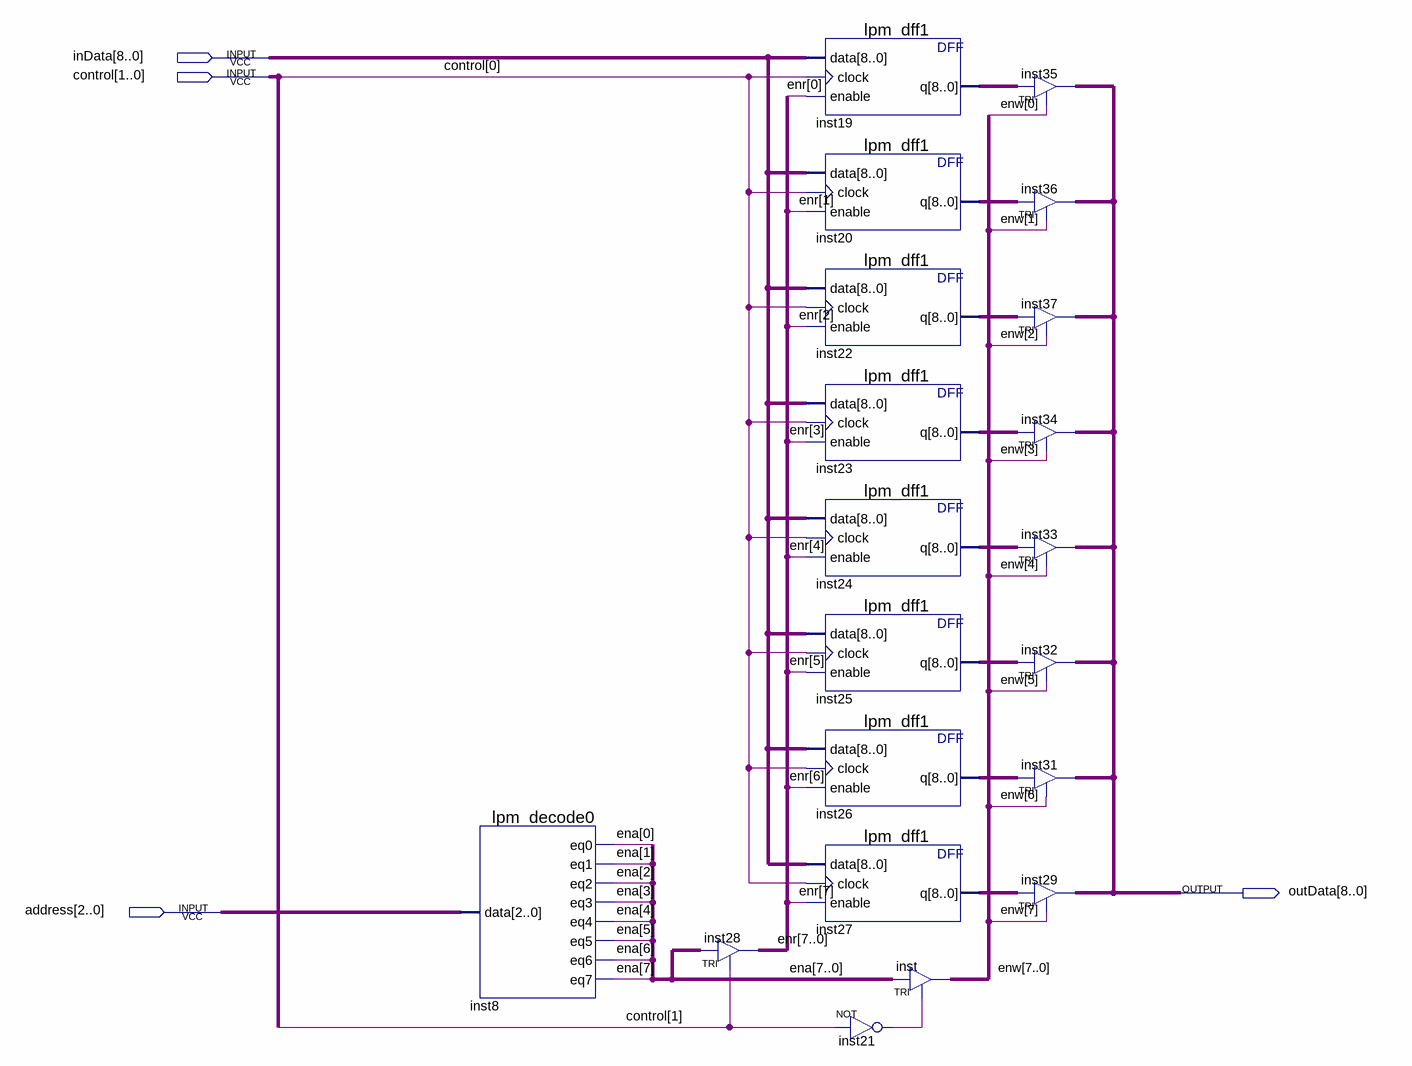
[diagram p0: schematic sheet]
// Quartus schematic REGS.bdf as structural Verilog: 20 symbols, 4 pins
module REGS (
  input  [8:0] inData,
  input  [1:0] control,
  input  [2:0] address,
  output [8:0] outData
);

  wire inst21_out;
  wire [7:0] ena, enr, enw;
  wire [8:0] inst19_q, inst20_q, inst22_q, inst23_q, inst24_q, inst25_q, inst26_q, inst27_q;

  lpm_decode0 inst8 (
    .data(address), .eq0(ena[0]), .eq1(ena[1]), .eq2(ena[2]), .eq3(ena[3]), .eq4(ena[4]), .eq5(ena[5]),
    .eq6(ena[6]), .eq7(ena[7]));
  TRI inst28[7:0] (.IN(ena), .OE(control[1]), .OUT(enr));
  lpm_dff1 inst19 (.data(inData), .clock(control[0]), .enable(enr[0]), .q(inst19_q));
  lpm_dff1 inst20 (.data(inData), .clock(control[0]), .enable(enr[1]), .q(inst20_q));
  lpm_dff1 inst22 (.data(inData), .clock(control[0]), .enable(enr[2]), .q(inst22_q));
  lpm_dff1 inst23 (.data(inData), .clock(control[0]), .enable(enr[3]), .q(inst23_q));
  lpm_dff1 inst24 (.data(inData), .clock(control[0]), .enable(enr[4]), .q(inst24_q));
  lpm_dff1 inst25 (.data(inData), .clock(control[0]), .enable(enr[5]), .q(inst25_q));
  lpm_dff1 inst26 (.data(inData), .clock(control[0]), .enable(enr[6]), .q(inst26_q));
  lpm_dff1 inst27 (.data(inData), .clock(control[0]), .enable(enr[7]), .q(inst27_q));
  TRI inst[7:0] (.IN(ena), .OE(inst21_out), .OUT(enw));
  not inst21 (inst21_out, control[1]);
  TRI inst35[8:0] (.IN(inst19_q), .OE(enw[0]), .OUT(outData));
  TRI inst36[8:0] (.IN(inst20_q), .OE(enw[1]), .OUT(outData));
  TRI inst37[8:0] (.IN(inst22_q), .OE(enw[2]), .OUT(outData));
  TRI inst34[8:0] (.IN(inst23_q), .OE(enw[3]), .OUT(outData));
  TRI inst33[8:0] (.IN(inst24_q), .OE(enw[4]), .OUT(outData));
  TRI inst32[8:0] (.IN(inst25_q), .OE(enw[5]), .OUT(outData));
  TRI inst31[8:0] (.IN(inst26_q), .OE(enw[6]), .OUT(outData));
  TRI inst29[8:0] (.IN(inst27_q), .OE(enw[7]), .OUT(outData));
endmodule
